# EAGLE design MRCS-PCR-SIN03-Breakout (EAGLE 7.7.0)
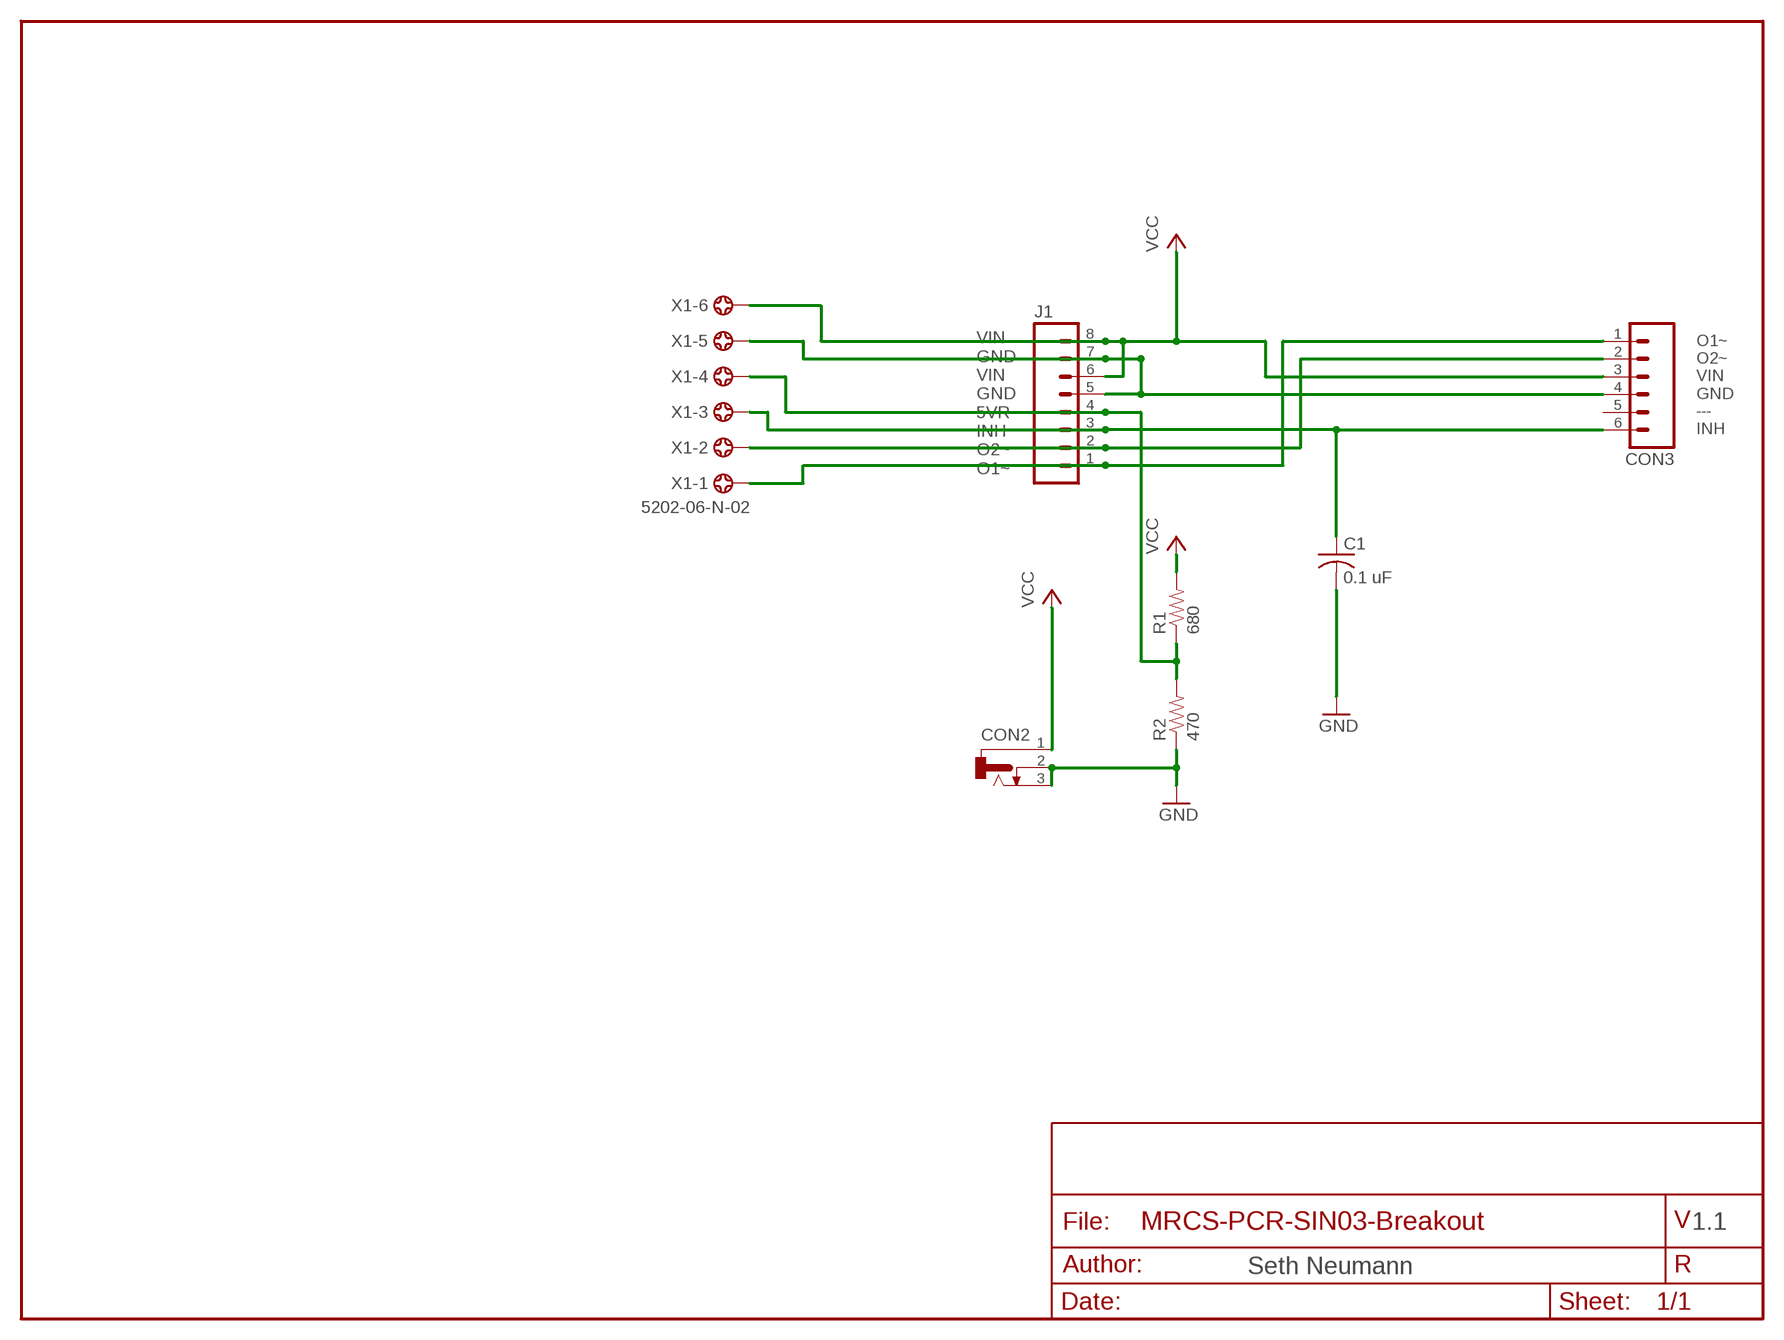
[diagram p0: schematic, sheet 1]

## Parts
C1  0.1 uF  CAPPTH2  [C-PTH-0.100]
CON2  CONNECTOR-DC-POWER-RA  [DCJ0202]
CON3  CONNECTOR-M06POLAR  [MOLEX-1X6]
J1  CONNECTOR-M08LOCK  [1X08_LOCK]
R1  680  RPTH04  [AXIAL-0.4-RES]
R2  470  RPTH04  [AXIAL-0.4-RES]
X1  5202-06-N-02  [5202-06-N-02]

## Nets
5VR: J1.4 R1.P$1 R2.P$2 X1.4
GND: C1.2 CON2.2 CON2.3 CON3.4 J1.5 J1.7 R2.P$1 X1.5
INH: C1.1 CON3.6 J1.3 X1.3
O1: CON3.1 J1.1 X1.1
O2: CON3.2 J1.2 X1.2
VCC: CON2.1 CON3.3 J1.6 J1.8 R1.P$2 X1.6
Unconnected: CON3.5

## Notes on the sheet
- O1~
  O2~
  VIN
  GND
  ---
  INH
- VIN
  GND
  VIN
  GND
  5VR
  INH
  O2~
  O1~
- 1.1
- Seth Neumann

## Library data of the parts
C1 = SPCoast:CAP*
CON2 = SPCoast:CONNECTOR-DC-POWER: DC POWER JACK
CON3 = SPCoast:CONNECTOR-M06: Header 6 Standard 6-pin 0.1" header
J1 = SPCoast:CONNECTOR-M08: Header 8 Standard 8-pin 0.1" header. Use with straight break away headers (SKU : PRT-00116), right angle break away headers (PRT-00553), swiss pins (PRT-00743), machine pins (PRT-00117), and female headers (PRT-00115).
R1 R2 = SPCoast:R*: Resistor Basic schematic elements and footprints for 0603, 1206, and PTH 1/10th watt (small) resistors.
X1 = con-ebyelectro:5202-06-N-02: Barrier Blocks Sreies 5202 Source: http://www.ebyelectro.com/PDF/5202-XX-N-02.pdf; OC_FARNELL: unknown; OC_NEWARK: unknown

## Board
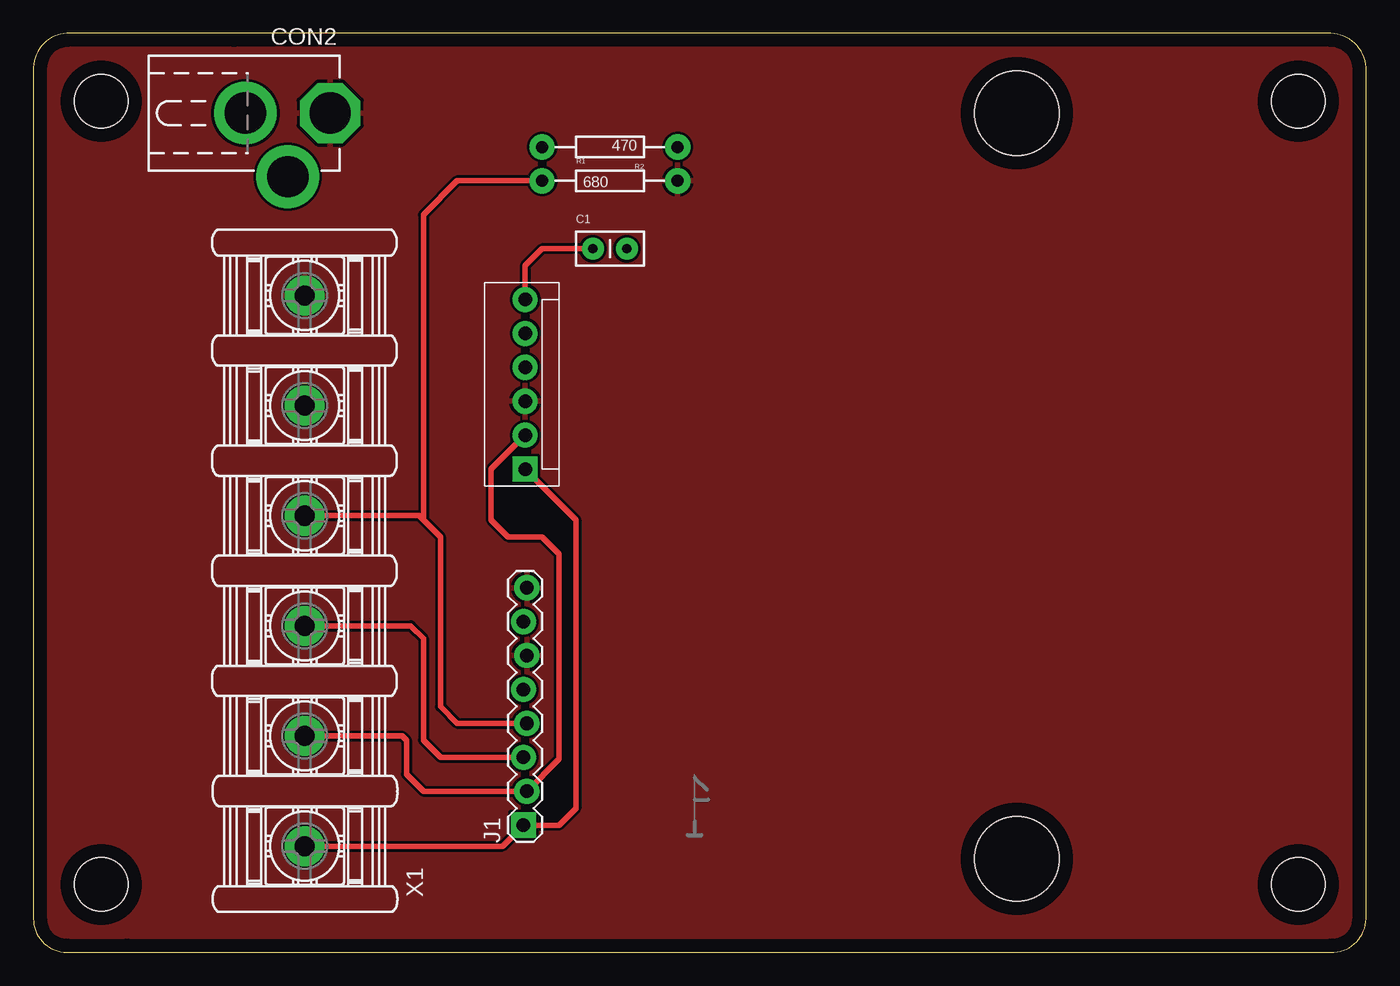
[diagram p1: board, top side]
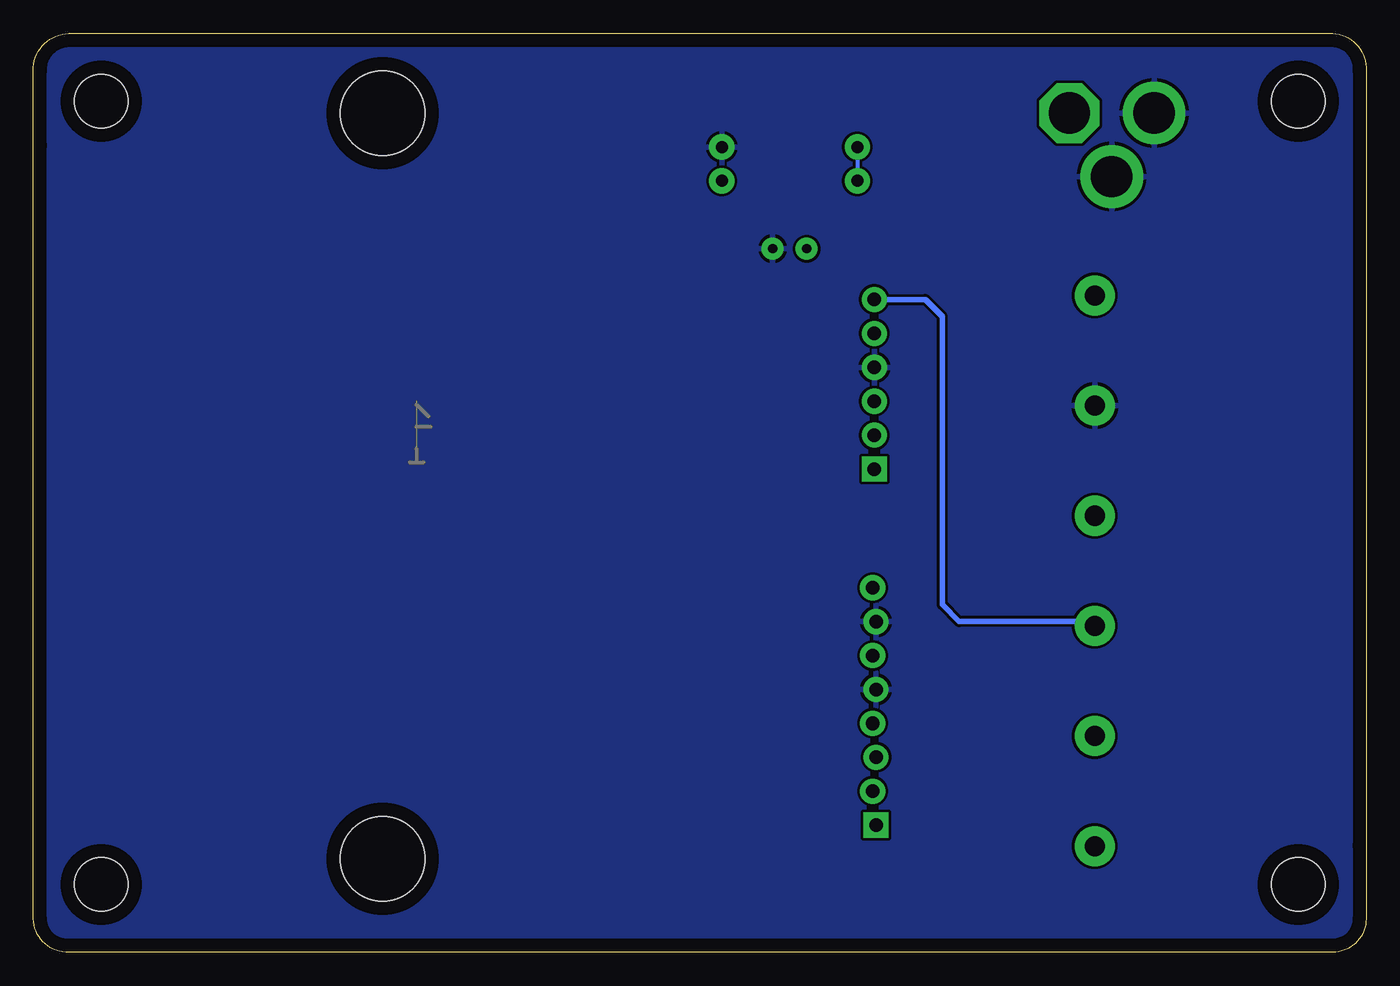
[diagram p2: board, bottom side, seen from below]

Size 99.82 x 68.83 mm. Coordinates in mm from the lower left corner, seen from the top.
Copper layers (1*16): Top 0.035mm / dielectric 1.5mm / Bottom 0.035mm
Design rules "default": minimum track width 10mil, minimum drill 24mil, track to track 8mil, track to pad 8mil, pad to pad 8mil, via to via 8mil, smd to smd 8mil, copper to edge 40mil, drill to drill 8mil, minimum pad ring 10mil, minimum via ring 8mil, stop-mask expansion 4mil, vias tented up to drill 0mil, thermal gap 10mil
Holes 6.35 mm at 73.66,62.87 73.66,6.99

### Footprints (pad centres in the part's own frame; a part is rotated, then mirrored left to right if it is on the bottom)
C-PTH-0.100 = drill 0.7 pad 1.651: 1 -1.27,0; 2 1.27,0
DCJ0202 = drill 3.1 pad 4.5 octagon: 1 0,3.175 | drill 3.1 pad 4.7: 2 4.763,0; 3 0,-3.175
MOLEX-1X6 = drill 1.016 pad 1.88 square: 1 0,0 | drill 1.016 pad 1.88: 2 2.54,0; 3 5.08,0; 4 7.62,0; 5 10.16,0; 6 12.7,0
1X08_LOCK = drill 1.016 pad 1.88 square: 1 0,0.127 | drill 1.016 pad 1.88: 2 2.54,-0.127; 3 5.08,0.127; 4 7.62,-0.127; 5 10.16,0.127; 6 12.7,-0.127; 7 15.24,0.127; 8 17.78,-0.127
AXIAL-0.4-RES = drill 0.9 pad 1.88: P$1 -5.08,0; P$2 5.08,0
BOARD-DINRAIL-2.7IN = hole 4: 94.742,5.08; 5.08,63.754; 94.742,63.754; 5.08,5.08
5202-06-N-02 = drill 1.5 pad 3: 1 -20.625,0; 2 -12.375,0; 3 -4.125,0; 4 4.125,0; 5 12.375,0; 6 20.625,0

### Placement (x,y rotation side)
C1  43.18,52.71 0 top
CON2  19.05,62.87 270 top
CON3  36.83,36.2 90 top
J1  36.83,9.53 90 top
R1  43.18,57.79 0 top
R2  43.18,60.33 180 top
U$1  [BOARD-DINRAIL-2.7IN]  0,0 0 top
U$2  [MRCSLOGOTOP]  48.26,8.26 0 top
U$3  [CA-PROP65WARNING]  66.04,53.98 0 top
U$4  [MRCSLOGOBTM]  64.77,36.2 0 top
X1  20.32,28.57 90 top

### Tracks (layer width: path | path; a pad name or v marks a point on that pad's centre or on a via)
5VR
  Top 0.406: X1.4 28.9,32.7 29.21,32.39 | 29.21,32.39 30.48,31.11 30.48,18.41 31.75,17.14 J1.4 | R1.P$1 31.75,57.79 29.21,55.25 29.21,32.39
  Bottom 0.305: R2.P$2 R1.P$1
GND
  pour Bottom: 0,0.64 100.33,0.64 100.33,69.21 0,69.21
INH
  Top 0.406: C1.1 38.1,52.71 36.83,51.44 CON3.6 | X1.3 28.26,24.45 29.21,23.49 29.21,15.88 30.48,14.61 J1.3
  Bottom 0.406: CON3.6 33.02,48.9 31.75,47.62 31.75,26.04 30.48,24.76 20.64,24.76 X1.3
O1
  Top 0.406: X1.1 35.13,7.95 J1.1 39.37,9.53 40.64,10.79 40.64,32.39 CON3.1
O2
  Top 0.406: X1.2 27.62,16.2 27.94,15.88 27.94,13.34 29.21,12.06 J1.2 39.37,14.48 39.37,29.84 38.1,31.11 35.56,31.11 34.29,32.39 34.29,36.2 CON3.2
VCC
  pour Top: 0,0.64 100.33,0.64 100.33,69.21 0,69.21

### Text on the board
tDocu: Version 1.2 / 20231007 | PCR SIN03 Breakout | INH YEL / --- / GND BLK / VIN RED / O2~ WHT / O1~ BLU | PCR-SIN03V12F20-C | VIN / GND / VIN / GND / 5VR / INH / O2~ / O1~ | V / G / R / I / O / O | Seth Neumann